# Altium project PDB.PrjPCB
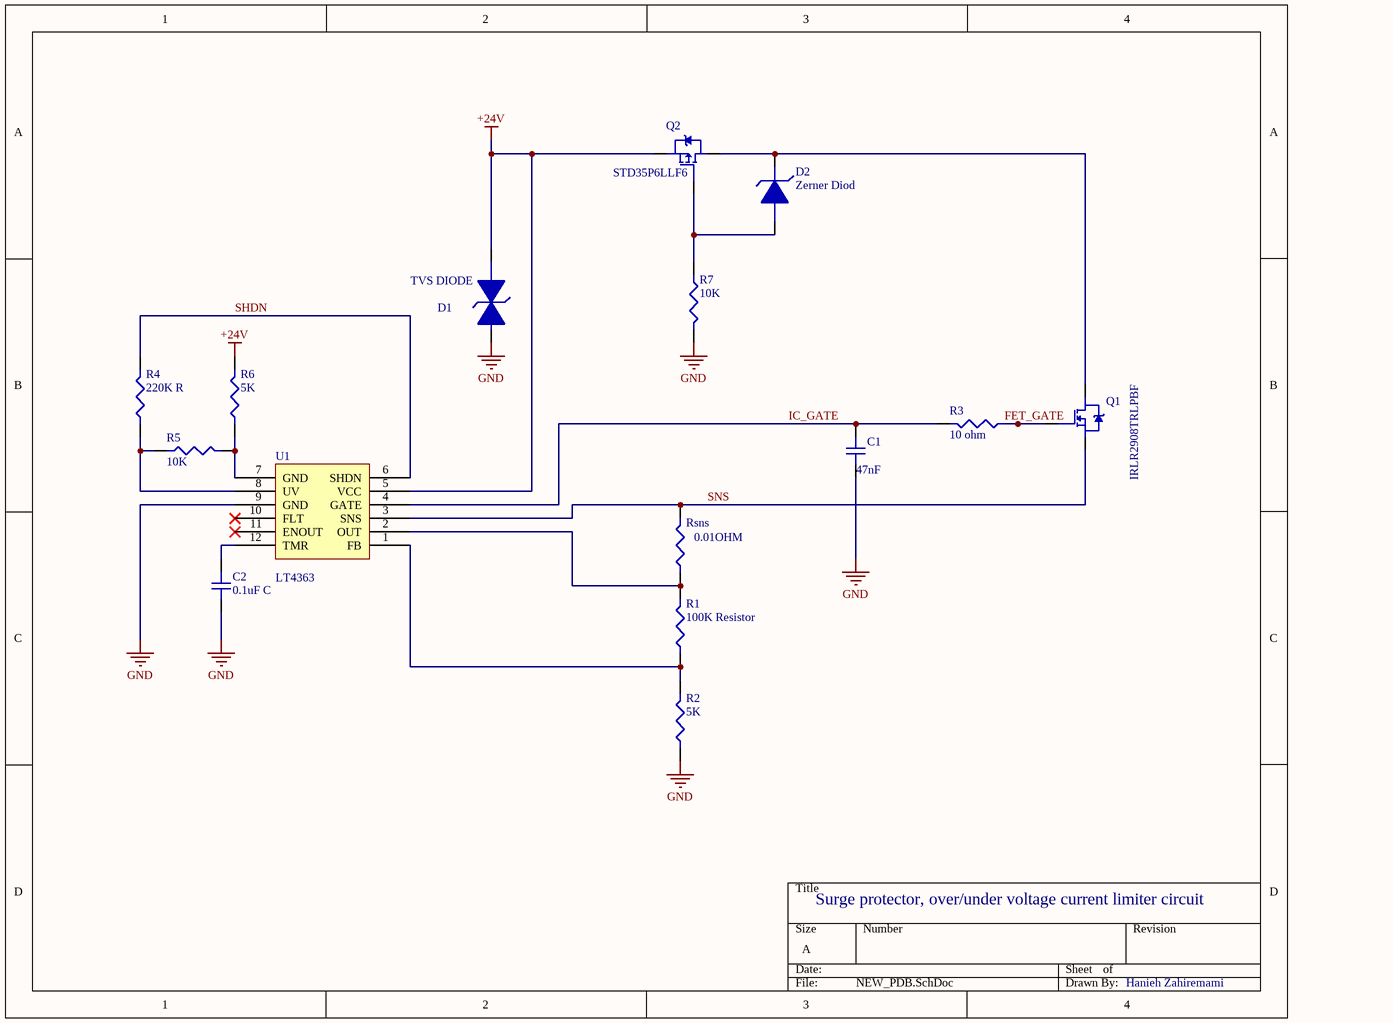
[diagram p0: NEW_PDB.SchDoc]
1 sheet, 15 parts. Net scope: global (net labels, ports and power ports of the same name join across sheets).
Board file: PDB.PcbDoc

## Sheet NEW_PDB.SchDoc
size A

### Parts
C1  47nF  [CAPC1613X09N]
C2  0.1uF C  [CAPC1613X09N]
D1  TVS DIODE  [DIODE_TVS]
D2  Zerner Diod  [DIOM3716X14N]
Q1  IRLR2908TRLPBF  [DPAK]
Q2  STD35P6LLF6  [DPAK]
R1  100K Resistor  [R0805]
R2  5K  [R0805]
R3  10 ohm  [R0805]
R4  220K R  [R0805]
R5  10K  [R0805]
R6  5K  [R0805]
R7  10K  [R0805]
Rsns  0.01OHM  [R2512]
U1  LT4363  [TSOP65P490X110-12N]

### Nets
+24V: D1.2 Q2.4 R6.2 U1.5(VCC)
GND: C1.1 C2.1 D1.1 R2.1 R7.2 U1.9(GND)
FET_GATE: Q1.1 R3.1
IC_GATE: C1.2 R3.2 U1.4(GATE)
SHDN: R4.2 U1.6(SHDN)
SNS: Q1.3 Rsns.2 U1.3(SNS)
NetC2_2: C2.2 U1.12(TMR)
NetD2_1: D2.1 Q1.4 Q2.3
NetD2_2: D2.2 Q2.1 R7.1
NetR1_1: R1.1 R2.2 U1.1(FB)
NetR1_2: R1.2 Rsns.1 U1.2(OUT)
NetR4_1: R4.1 R5.1 U1.8(UV)
NetR5_2: R5.2 R6.1 U1.7(GND)

Not connected (* = marked no-connect by the designer): U1 10(FLT)* 11(ENOUT)*

### Notes on the sheet
- Surge protector, over/under voltage current limiter circuit
- Hanieh Zahiremami

### Library data of the parts
C1 = GCM188R71H473KA55D: CAP CER 0.047UF 50V X7R 0603; Manufacturer: Murata; Tolerance: 10%; Supplier 1: Digi-Key; Manufacturer Part Number: GCM188R71H473KA55D; Stock 1: 40000; Pricing 1: 1=0.16, 10=0.115, 100=0.054, 500=0.03788, 1000=0.03136 (USD); Mount: Surface Mount; Case/Package: 0603; Case Code (Metric): 1608; Case Code (Imperial): 0603; Min Operating Temperature: -55°C; Max Operating Temperature: 125°C; Capacitance: 47nF; Packaging: Tape and Reel; Package Quantity: 1; Voltage Rating: 50V; Dielectric: X7R; Voltage Rating (DC): 50V; Termination: SMD/SMT; Voltage: 50V; Length: 1.6mm; Height: 0.8mm; Width: 0.031inch; Thickness: 0.035inch; Depth: 0.8mm; Ratings: AEC-Q200; Radiation Hardening: No; REACH SVHC: No SVHC; Lead Free: Lead Free; Supplier Part Number 1: 490-4934-1-ND
C2 = CL05A104KA5NNNC: Cap Ceramic 0.1uF 25V X5R 10% SMD 0402 85C Paper T/R; Manufacturer: Samsung; Capacitance: 100nF; Supplier 1: Digi-Key; Manufacturer Part Number: CL05A104KA5NNNC; Stock 1: 100000; Pricing 1: 1=0.1, 10=0.032, 100=0.0141, 500=0.01006, 1000=0.00791, 2500=0.00719, 5000=0.00661 (USD); Mount: Surface Mount; Case/Package: 0402; Case Code (Metric): 1005; Case Code (Imperial): 0402; Min Operating Temperature: -55°C; Max Operating Temperature: 85°C; Packaging: Tape and Reel; Tolerance: 10%; Package Quantity: 1; Voltage Rating: 25V; Dielectric: X5R; Voltage: 25V; Voltage Rating (DC): 25V; Length: 1mm; Height: 0.5mm; Width: 0.02inch; Thickness: 0.022inch; Depth: 0.5mm; Radiation Hardening: No; Lead Free: Lead Free; Supplier Part Number 1: 1276-1043-6-ND
D1 = SMAJ58A-13-F: TVS DIODE 58VWM 93.6VC SMA; Manufacturer: Diodes; Direction: Unidirectional; Reverse Breakdown Voltage: 64.4V; Number of Elements: 1; Max Surge Current: 40A; Reverse Standoff Voltage: 58V; Clamping Voltage: 93.6V; Peak Pulse Power: 400W; Power Line Protection: No; Max Reverse Leakage Current: 5uA; Test Current: 1mA; Peak Pulse Current: 4.3A; Max Breakdown Voltage: 71.2V; Element Configuration: Single; Current: 43A; Forward Voltage: 3.5V; Capacitance: 180pF; Supplier 1: Digi-Key; Manufacturer Part Number: SMAJ58A-13-F; Stock 1: 387453; Pricing 1: 1=0.41, 10=0.311, 100=0.1937, 500=0.13256, 1000=0.10197 (USD); Mount: Surface Mount; Case/Package: SMA; Number of Pins: 2; Contact Plating: Matte,Tin; Min Operating Temperature: -55°C; Max Operating Temperature: 150°C; Package Quantity: 5000; Packaging: Tape and Reel; Number of Unidirectional Channels: 1; Min Breakdown Voltage: 64.4V; Polarity: Unidirectional; Breakdown Voltage: 64.4V; Termination: SMD/SMT; Power Dissipation: 400W; Leakage Current: 5uA; Working Voltage: 58V; Max Power Dissipation: 400W; ESD Protection: No; Voltage: 58V; Max Output Current: 4.3A; Composition: Zener; Length: 2.92mm; Height: 2.3mm; Width: 4.6mm; Radiation Hardening: No; Lead Free: Lead Free; Supplier Part Number 1: SMAJ58A-13-FDIDKR-ND
D2 = 1N4148W-TP: DIODE GEN PURP 100V 150MA SOD123; Manufacturer: MCC; Max Surge Current: 2A; Forward Voltage: 1V; Recovery Time: 4ns; Max Reverse Leakage Current: 5uA; Power Dissipation: 400mW; Max Forward Surge Current (Ifsm): 1A; Element Configuration: Single; Polarity: Standard; Capacitance: 4pF; Supplier 1: Digi-Key; Manufacturer Part Number: 1N4148W-TP; Stock 1: 546277; Pricing 1: 1=0.14, 10=0.131, 100=0.0856, 500=0.04186, 1000=0.02854 (USD); Mount: Surface Mount; Number of Pins: 2; Min Operating Temperature: -65°C; Max Operating Temperature: 150°C; Packaging: Tape and Reel; Forward Current: 150mA; Package Quantity: 3000; Average Rectified Current: 150mA; Reverse Recovery Time: 4ns; Max Repetitive Reverse Voltage (Vrrm): 100V; Peak Non-Repetitive Surge Current: 2A; Voltage Rating (DC): 100V; Current Rating: 150mA; Output Current: 150mA; Max Reverse Voltage (DC): 100V; Length: 2.85mm; Height: 1.2mm; Width: 1.8mm; Radiation Hardening: No; REACH SVHC: Unknown; Lead Free: Lead Free; Supplier Part Number 1: 1N4148WTPMSDKR-ND
Q1 = IRLR2908TRLPBF: MOSFET N-CH 80V 30A DPAK; Manufacturer: International Rectifier; Rds On Max: 28mR; Input Capacitance: 1.89nF; Rise Time: 95ns; Nominal Vgs: 1V; Number of Elements: 1; Continuous Drain Current (ID): 39A; Max Power Dissipation: 120W; Fall Time: 55ns; Turn-On Delay Time: 12ns; Turn-Off Delay Time: 36ns; Element Configuration: Single; Gate to Source Voltage (Vgs): 16V; Supplier 1: Digi-Key; Manufacturer Part Number: IRLR2908TRLPBF; Stock 1: 4490; Pricing 1: 1=1.4, 10=1.239, 100=0.9794, 500=0.75958, 1000=0.59966 (USD); Mount: Surface Mount; Case/Package: DPAK; Number of Pins: 3; Min Operating Temperature: -55°C; Max Operating Temperature: 175°C; Package Quantity: 1; Packaging: Tape and Reel; Drain to Source Voltage (Vdss): 80V; Drain to Source Breakdown Voltage: 80V; Drain to Source Resistance: 28mR; Power Dissipation: 120W; Threshold Voltage: 1V; On-State Resistance: 28MR; Length: 6.73mm; Height: 2.26mm; Width: 6.22mm; Radiation Hardening: No; REACH SVHC: No SVHC; Supplier Part Number 1: IRLR2908TRLPBFDKR-ND
Q2 = STD35P6LLF6: POWER MOSFET; Manufacturer: STMicroelectronics; Drain to Source Voltage (Vdss): 60V; Continuous Drain Current (ID): 35A; Rds On Max: 28mR; Input Capacitance: 3.78nF; Max Power Dissipation: 70W; Supplier 1: Digi-Key; Manufacturer Part Number: STD35P6LLF6; Stock 1: 7152; Pricing 1: 1=1.41, 10=1.248, 100=0.9867, 500=0.76518, 1000=0.6041 (USD); Mount: Surface Mount; Case/Package: TO-252-3; Packaging: Tape and Reel; Supplier Part Number 1: 497-15462-6-ND
R1 = ERA-6AEB104V: Res Thin Film 0805 100K Ohm 0.1% 0.125W(1/8W) ±25ppm/C Molded SMD Automotive Punched T/R; Manufacturer: Panasonic; Resistance: 100kR; Power Rating: 125mW; Voltage Rating: 100V; Temperature Coefficient: 25ppm/°C; Supplier 1: Arrow; Manufacturer Part Number: ERA-6AEB104V; Stock 1: 2428; Pricing 1: 1=0.324, 10=0.2241, 25=0.2017, 100=0.1064, 250=0.0956, 500=0.0945, 1000=0.0477, 3000=0.0408 (USD); Mount: Surface Mount; Case/Package: 0805; Number of Pins: 2; Case Code (Imperial): 0805; Case Code (Metric): 2012; Contact Plating: Tin; Min Operating Temperature: -55°C; Max Operating Temperature: 155°C; Packaging: Tape and Reel; Tolerance: 0.1%; Composition: Thin Film; Military Standard: Not; Termination: Solder; Voltage Rating (DC): 100V; Package Quantity: 1; Number of Terminations: 2; Max Power Dissipation: 125mW; Features: Automotive AEC-Q200; Length: 2mm; Height: 0.5mm; Width: 1.25mm; Depth: 1.25mm; Radiation Hardening: No; REACH SVHC: No SVHC; Lead Free: Lead Free; Supplier Part Number 1: ERA-6AEB104V
R2 R6 = PNM0805E5001BST5: Thin Film Resistors - SMD 200mW 5Kohm 0.1% 25ppm; Manufacturer: Vishay Dale Thin Film; Resistance: 5kR; Voltage Rating: 100V; Temperature Coefficient: 25ppm/°C; Supplier 1: Farnell; Manufacturer Part Number: PNM0805E5001BST5; Stock 1: 1231; Pricing 1: 1=2.59, 10=1.9, 50=1.53, 100=1.36 (GBP); Case/Package: 0805; Case Code (Imperial): 0805; Case Code (Metric): 2012; Min Operating Temperature: -55°C; Max Operating Temperature: 125°C; Power Rating: 200mW; Tolerance: 0.1%; Packaging: Tape and Reel; Composition: Thin Film; Voltage Rating (DC): 100V; Length: 0.08inch; Height: 0.015inch; Width: 0.05inch; Radiation Hardening: No; REACH SVHC: Unknown; Supplier Part Number 1: 1857222
R3 = RL1220S-100-F: RES SMD 10 OHM 1% 1/3W 0805; Manufacturer: Susumu; Resistance: 10R; Power Rating: 250mW; Temperature Coefficient: 200ppm/°C; Max Power Dissipation: 333mW; Voltage Rating (DC): 100V; Supplier 1: Mouser; Manufacturer Part Number: RL1220S-100-F; Stock 1: 32764; Pricing 1: 1=0.34, 10=0.156, 50=0.156, 100=0.07, 1000=0.048, 10000=0.034 (USD); Case/Package: 0805; Number of Pins: 2; Weight: 0.000194oz; Case Code (Metric): 2012; Case Code (Imperial): 0805; Min Operating Temperature: -55°C; Max Operating Temperature: 125°C; Tolerance: 1%; Packaging: Tape and Reel; Package Quantity: 1; Composition: Thin Film; Number of Terminations: 2; Termination: SMD/SMT; Length: 0.079inch; Height: 0.02inch; Width: 0.049inch; REACH SVHC: Unknown; Lead Free: Lead Free; Supplier Part Number 1: 754-RL1220S-100-F
R4 = KTR10EZPF2203: RES 220K OHM 1/8W 1% 0805 SMD; Manufacturer: Rohm; Resistance: 220000R; Supplier 1: Digi-Key; Manufacturer Part Number: KTR10EZPF2203; Stock 1: 23335; Pricing 1: 1=0.19, 10=0.16, 100=0.0624, 1000=0.02614, 2500=0.02396 (USD); Case/Package: 0805; Supplier Part Number 1: RHM220KAHDKR-ND
R5 R7 = RNCF0805DTE10K0: Res Thin Film 0805 10K Ohm 0.5% 0.1W(1/10W) ±25ppm/C Molded SMD Paper T/R; Manufacturer: Stackpole Electronics; Resistance: 10kR; Max Power Dissipation: 125mW; Temperature Coefficient: 25ppm/°C; Supplier 1: Digi-Key; Manufacturer Part Number: RNCF0805DTE10K0; Stock 1: 377154; Pricing 1: 1=0.17, 10=0.14, 100=0.0546, 1000=0.02287, 2500=0.02096 (USD); Mount: Surface Mount; Case/Package: 0805; Case Code (Metric): 2012; Case Code (Imperial): 0805; Contact Plating: Matte,Tin; Min Operating Temperature: -55°C; Max Operating Temperature: 155°C; Packaging: Tape and Reel; Tolerance: 0.5%; Composition: Thin Film; Number of Terminations: 2; Military Standard: Not; Features: Moisture Resistant; Length: 2mm; Height: 0.026inch; Width: 0.049inch; Depth: 1.25mm; Radiation Hardening: No; Supplier Part Number 1: RNCF0805DTE10K0DKR-ND
Rsns = PE2512FKE7W0R01L: RES SMD 0.01 OHM 1% 2W 2512; Manufacturer: Yageo; Resistance: 10mR; Temperature Coefficient: 50ppm/°C; Supplier 1: Digi-Key; Manufacturer Part Number: PE2512FKE7W0R01L; Stock 1: 15960; Pricing 1: 1=0.57, 10=0.479, 25=0.4104, 50=0.3694, 100=0.3215, 250=0.28732, 500=0.23258, 1000=0.18812 (USD); Case/Package: 2512; Case Code (Metric): 6432; Case Code (Imperial): 2512; Min Operating Temperature: -55°C; Max Operating Temperature: 170°C; Packaging: Tape and Reel; Composition: Metal Film; Number of Terminations: 2; Tolerance: 1%; Max Power Dissipation: 2W; Features: Automotive AEC-Q200,Moisture Resistant; Length: 0.248inch; Height: 0.03inch; Width: 0.122inch; Lead Free: Lead Free
U1 = LT4363CMS-2#PBF: IC SURGE STOPPER HV 12-MSOP; Manufacturer: Analog Devices / Linear Technology; Min Supply Voltage: 4V; Max Supply Voltage: 80V; Clamping Voltage: 27V; Number of Circuits: 1; Supplier 1: Digi-Key; Manufacturer Part Number: LT4363CMS-2#PBF; Stock 1: 1640; Pricing 1: 1=5.41, 25=3.6108, 100=3.0702 (USD); Case/Package: MSOP; Number of Pins: 12; Min Operating Temperature: 0°C; Max Operating Temperature: 70°C; Package Quantity: 37; Packaging: Rail/Tube; Working Voltage: 80V; REACH SVHC: No SVHC; Lead Free: Lead Free; Supplier Part Number 1: LT4363CMS-2#PBF-ND